# EAGLE design untitled2 (EAGLE 7.6.0)
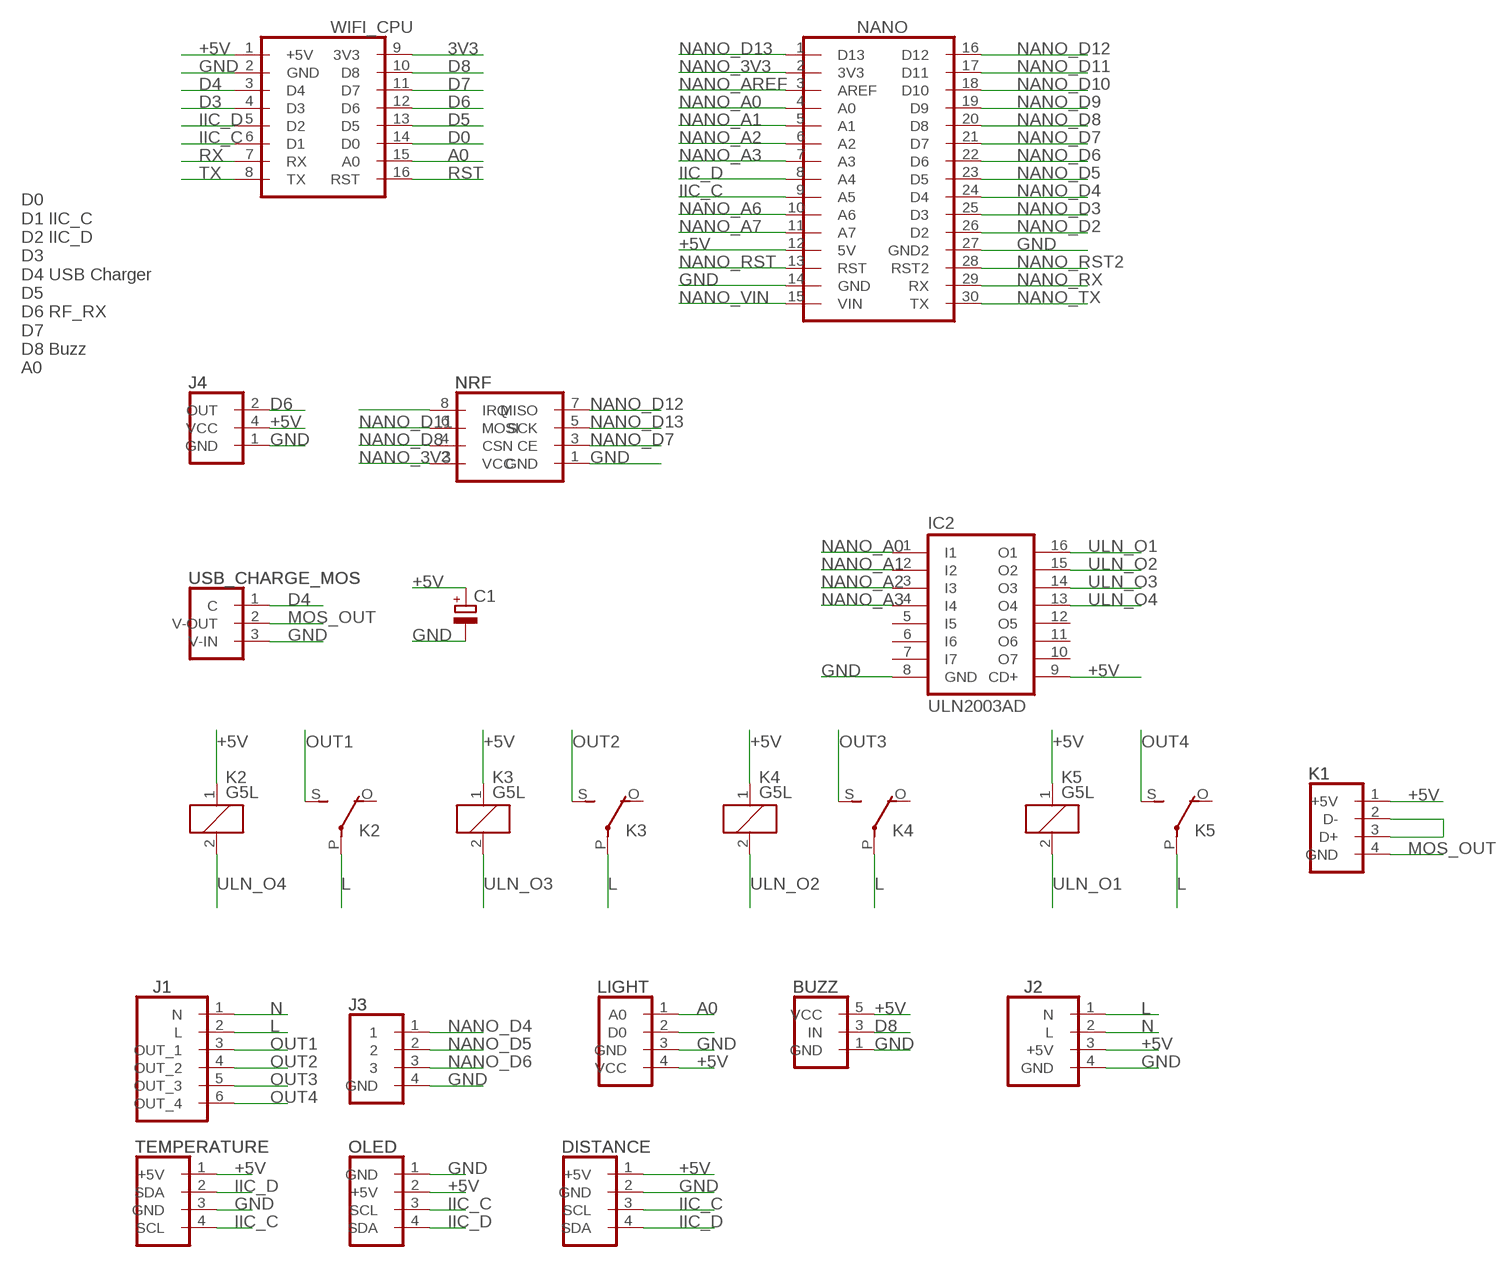
[diagram p0: schematic, sheet 1]

## Parts
BUZZ  BUZZ_MODULE  [BUZZ_MODULE]
C1  CPOL-EUE5-5  [E5-5]
DISTANCE  IIC_DISTANCE  [IIC_DISTANCE]
IC2  ULN2003AD  [SO16]
J1  OUT_HEAD_6_AC_4CH  [OUT_HEAD_6_AC_4CH]
J2  AC_DCSIDE_2A  [AC_DC_SIDE_2A]
J3  SELECT_1_IN_3  [SELECT_1_IN_3]
J4  315MHZ_RX_SMT_LONG  [315MHZ_RX_SMT_LONG]
K1  USB_OUTUSB_V  [USB_V_OUT]
K2  G5L  [G5LE]
K3  G5L  [G5LE]
K4  G5L  [G5LE]
K5  G5L  [G5LE]
LIGHT  LIGHT_DEC  [LIGHT_DEC]
NANO  ARDUINO_NANO  [ARDUINO_NANO]
NRF  NRF24L01_MODULE  [NRF24L01]
OLED  IIC_OLED  [IIC_OLED]
TEMPERATURE  IIC_TEMPERATURE  [IIC_TEMPERATURE]
USB_CHARGE_MOS  MOS_IRF520  [MOS_IRF520]
WIFI_CPU  ESP8266_MINI  [ESP8266_MINI]

## Nets
3V3: WIFI_CPU.9(3V3)
+5V: BUZZ.5(VCC) C1.+ DISTANCE.1(+5V) IC2.9(CD+) J2.3(+5V) J4.4(VCC) K1.1(+5V) K2.1 K3.1 K4.1 K5.1 LIGHT.4(VCC) NANO.12(5V) OLED.2(+5V) TEMPERATURE.1(+5V) WIFI_CPU.1(+5V)
A0: LIGHT.1(A0) WIFI_CPU.15(A0)
D0: WIFI_CPU.14(D0)
D3: WIFI_CPU.4(D3)
D4: USB_CHARGE_MOS.1(C) WIFI_CPU.3(D4)
D5: WIFI_CPU.13(D5)
D6: J4.2(OUT) WIFI_CPU.12(D6)
D7: WIFI_CPU.11(D7)
D8: BUZZ.3(IN) WIFI_CPU.10(D8)
GND: BUZZ.1(GND) C1.- DISTANCE.2(GND) IC2.8(GND) J2.4(GND) J3.4(GND) J4.1(GND) LIGHT.3(GND) NANO.14(GND) NANO.27(GND2) NRF.1(GND) OLED.1(GND) TEMPERATURE.3(GND) USB_CHARGE_MOS.3(V-IN) WIFI_CPU.2(GND)
IIC_C: DISTANCE.3(SCL) NANO.9(A5) OLED.3(SCL) TEMPERATURE.4(SCL) WIFI_CPU.6(D1)
IIC_D: DISTANCE.4(SDA) NANO.8(A4) OLED.4(SDA) TEMPERATURE.2(SDA) WIFI_CPU.5(D2)
L: J1.2(L) J2.1(N) K2.P(2:P) K3.P(2:P) K4.P(2:P) K5.P(2:P)
MOS_OUT: K1.4(GND) USB_CHARGE_MOS.2(V-OUT)
N: J1.1(N) J2.2(L)
N$1: NRF.8(IRQ)
N$2: K1.2(D-) K1.3(D+)
N$3: LIGHT.2(D0)
NANO_3V3: NANO.2(3V3) NRF.2(VCC)
NANO_A0: IC2.1(I1) NANO.4(A0)
NANO_A1: IC2.2(I2) NANO.5(A1)
NANO_A2: IC2.3(I3) NANO.6(A2)
NANO_A3: IC2.4(I4) NANO.7(A3)
NANO_A6: NANO.10(A6)
NANO_A7: NANO.11(A7)
NANO_AREF: NANO.3(AREF)
NANO_D2: NANO.26(D2)
NANO_D3: NANO.25(D3)
NANO_D4: J3.1 NANO.24(D4)
NANO_D5: J3.2 NANO.23(D5)
NANO_D6: J3.3 NANO.22(D6)
NANO_D7: NANO.21(D7) NRF.3(CE)
NANO_D8: NANO.20(D8) NRF.4(CSN)
NANO_D9: NANO.19(D9)
NANO_D10: NANO.18(D10)
NANO_D11: NANO.17(D11) NRF.6(MOSI)
NANO_D12: NANO.16(D12) NRF.7(MISO)
NANO_D13: NANO.1(D13) NRF.5(SCK)
NANO_RST: NANO.13(RST)
NANO_RST2: NANO.28(RST2)
NANO_RX: NANO.29(RX)
NANO_TX: NANO.30(TX)
NANO_VIN: NANO.15(VIN)
OUT1: J1.3(OUT_1) K2.S(2:S)
OUT2: J1.4(OUT_2) K3.S(2:S)
OUT3: J1.5(OUT_3) K4.S(2:S)
OUT4: J1.6(OUT_4) K5.S(2:S)
RST: WIFI_CPU.16(RST)
RX: WIFI_CPU.7(RX)
TX: WIFI_CPU.8(TX)
ULN_O1: IC2.16(O1) K5.2
ULN_O2: IC2.15(O2) K4.2
ULN_O3: IC2.14(O3) K3.2
ULN_O4: IC2.13(O4) K2.2
Unconnected: IC2.5(I5) IC2.6(I6) IC2.7(I7) IC2.10(O7) IC2.11(O6) IC2.12(O5) K2.O(2:O) K3.O(2:O) K4.O(2:O) K5.O(2:O)

## Notes on the sheet
- D0
  D1 IIC_C
  D2 IIC_D
  D3
  D4 USB Charger
  D5
  D6 RF_RX
  D7
  D8 Buzz
  A0

## Library data of the parts
BUZZ = rx:BUZZ_MODULE: Multi connection point. Often used as Generic Header-pin footprint for 0.1 inch spaced/style header connections On any of the 0.1 inch spaced packages, you can populate with these: Break Away Headers - Straight <https://www.sparkfun.com/products/116> (PRT-00116) Break Away Male Headers - Right Angle <https://www.sparkfun.com/products/553> (PRT-00553) Female Headers <https://www.sparkfun.com/products/115> (PRT-00115) Break Away Headers - Machine Pin <https://www.sparkfun.com/products/117> (PRT-00117) Break Away Female Headers - Swiss Machine Pin <https://www.sparkfun.com/products/743> (PRT-00743)
C1 = resistor:CPOL-EU: POLARIZED CAPACITOR, European symbol
DISTANCE = rx:IIC_DISTANCE: Multi connection point. Often used as Generic Header-pin footprint for 0.1 inch spaced/style header connections On any of the 0.1 inch spaced packages, you can populate with these: Break Away Headers - Straight <https://www.sparkfun.com/products/116> (PRT-00116) Break Away Male Headers - Right Angle <https://www.sparkfun.com/products/553> (PRT-00553) Female Headers <https://www.sparkfun.com/products/115> (PRT-00115) Break Away Headers - Machine Pin <https://www.sparkfun.com/products/117> (PRT-00117) Break Away Female Headers - Swiss Machine Pin <https://www.sparkfun.com/products/743> (PRT-00743)
IC2 = uln-udn:ULN2003A: DRIVER ARRAY
J1 = rx:OUT_HEAD_6_AC_4CH: Multi connection point. Often used as Generic Header-pin footprint for 0.1 inch spaced/style header connections On any of the 0.1 inch spaced packages, you can populate with these: Break Away Headers - Straight <https://www.sparkfun.com/products/116> (PRT-00116) Break Away Male Headers - Right Angle <https://www.sparkfun.com/products/553> (PRT-00553) Female Headers <https://www.sparkfun.com/products/115> (PRT-00115) Break Away Headers - Machine Pin <https://www.sparkfun.com/products/117> (PRT-00117) Break Away Female Headers - Swiss Machine Pin <https://www.sparkfun.com/products/743> (PRT-00743)
J2 = rx:AC_DC: Multi connection point. Often used as Generic Header-pin footprint for 0.1 inch spaced/style header connections On any of the 0.1 inch spaced packages, you can populate with these: Break Away Headers - Straight <https://www.sparkfun.com/products/116> (PRT-00116) Break Away Male Headers - Right Angle <https://www.sparkfun.com/products/553> (PRT-00553) Female Headers <https://www.sparkfun.com/products/115> (PRT-00115) Break Away Headers - Machine Pin <https://www.sparkfun.com/products/117> (PRT-00117) Break Away Female Headers - Swiss Machine Pin <https://www.sparkfun.com/products/743> (PRT-00743)
J3 = rx:SELECT_1_IN_3: Multi connection point. Often used as Generic Header-pin footprint for 0.1 inch spaced/style header connections On any of the 0.1 inch spaced packages, you can populate with these: Break Away Headers - Straight <https://www.sparkfun.com/products/116> (PRT-00116) Break Away Male Headers - Right Angle <https://www.sparkfun.com/products/553> (PRT-00553) Female Headers <https://www.sparkfun.com/products/115> (PRT-00115) Break Away Headers - Machine Pin <https://www.sparkfun.com/products/117> (PRT-00117) Break Away Female Headers - Swiss Machine Pin <https://www.sparkfun.com/products/743> (PRT-00743)
J4 = rx:315MHZ_RX_SMT_LONG: Multi connection point. Often used as Generic Header-pin footprint for 0.1 inch spaced/style header connections On any of the 0.1 inch spaced packages, you can populate with these: Break Away Headers - Straight <https://www.sparkfun.com/products/116> (PRT-00116) Break Away Male Headers - Right Angle <https://www.sparkfun.com/products/553> (PRT-00553) Female Headers <https://www.sparkfun.com/products/115> (PRT-00115) Break Away Headers - Machine Pin <https://www.sparkfun.com/products/117> (PRT-00117) Break Away Female Headers - Swiss Machine Pin <https://www.sparkfun.com/products/743> (PRT-00743)
K1 = rx:USB_OUT: Multi connection point. Often used as Generic Header-pin footprint for 0.1 inch spaced/style header connections On any of the 0.1 inch spaced packages, you can populate with these: Break Away Headers - Straight <https://www.sparkfun.com/products/116> (PRT-00116) Break Away Male Headers - Right Angle <https://www.sparkfun.com/products/553> (PRT-00553) Female Headers <https://www.sparkfun.com/products/115> (PRT-00115) Break Away Headers - Machine Pin <https://www.sparkfun.com/products/117> (PRT-00117) Break Away Female Headers - Swiss Machine Pin <https://www.sparkfun.com/products/743> (PRT-00743)
K2-K5 = relay:G5L: RELAY 1 x switch, 10 A/120 V AC, 8 A/30 V ADC, Omron; OC_FARNELL: unknown; OC_NEWARK: unknown
LIGHT = rx:LIGHT_DEC: Multi connection point. Often used as Generic Header-pin footprint for 0.1 inch spaced/style header connections On any of the 0.1 inch spaced packages, you can populate with these: Break Away Headers - Straight <https://www.sparkfun.com/products/116> (PRT-00116) Break Away Male Headers - Right Angle <https://www.sparkfun.com/products/553> (PRT-00553) Female Headers <https://www.sparkfun.com/products/115> (PRT-00115) Break Away Headers - Machine Pin <https://www.sparkfun.com/products/117> (PRT-00117) Break Away Female Headers - Swiss Machine Pin <https://www.sparkfun.com/products/743> (PRT-00743)
NANO = rx:ARDUINO_NANO: Multi connection point. Often used as Generic Header-pin footprint for 0.1 inch spaced/style header connections On any of the 0.1 inch spaced packages, you can populate with these: Break Away Headers - Straight <https://www.sparkfun.com/products/116> (PRT-00116) Break Away Male Headers - Right Angle <https://www.sparkfun.com/products/553> (PRT-00553) Female Headers <https://www.sparkfun.com/products/115> (PRT-00115) Break Away Headers - Machine Pin <https://www.sparkfun.com/products/117> (PRT-00117) Break Away Female Headers - Swiss Machine Pin <https://www.sparkfun.com/products/743> (PRT-00743) For SCREWTERMINALS and SPRING TERMINALS visit here: Screw Terimnals on SparkFun.com <https://www.sparkfun.com/search/results?term=Screw+Terminals> (5mm/3.5mm/2.54mm spacing) This device is also useful as a general connection point to wire up your design to another part of your project. Our various solder wires solder well into these plated through hole pads. Hook-Up Wire - Assortment (Stranded, 22 AWG) <https://www.sparkfun.com/products/11375> (PRT-11375) Hook-Up Wire - Assortment (Solid Core, 22 AWG) <https://www.sparkfun.com/products/11367> (PRT-11367) View the entire wire category on our website here <https://www.sparkfun.com/categories/141> Special notes: Molex polarized connector foot print use with SKU : PRT-08231 with associated crimp pins and housings. 1MM SMD Version SKU: PRT-10208 NOTES ON THE VARIANTS LOCK and LOCK_LONGPADS... This footprint was designed to help hold the alignment of a through-hole component (i.e. 6-pin header) while soldering it into place. You may notice that each hole has been shifted either up or down by 0.005 of an inch from it's more standard position (which is a perfectly straight line). This slight alteration caused the pins (the squares in the middle) to touch the edges of the holes. Because they are alternating, it causes a "brace" to hold the component in place. 0.005 has proven to be the perfect amount of "off-center" position when using our standard breakaway headers. Although looks a little odd when you look at the bare footprint, once you have a header in there, the alteration is very hard to notice. Also,if you push a header all the way into place, it is covered up entirely on the bottom side.
NRF = rx:NRF24L01_MODULE: Multi connection point. Often used as Generic Header-pin footprint for 0.1 inch spaced/style header connections On any of the 0.1 inch spaced packages, you can populate with these: Break Away Headers - Straight <https://www.sparkfun.com/products/116> (PRT-00116) Break Away Male Headers - Right Angle <https://www.sparkfun.com/products/553> (PRT-00553) Female Headers <https://www.sparkfun.com/products/115> (PRT-00115) Break Away Headers - Machine Pin <https://www.sparkfun.com/products/117> (PRT-00117) Break Away Female Headers - Swiss Machine Pin <https://www.sparkfun.com/products/743> (PRT-00743)
OLED = rx:IIC_OLED: Multi connection point. Often used as Generic Header-pin footprint for 0.1 inch spaced/style header connections On any of the 0.1 inch spaced packages, you can populate with these: Break Away Headers - Straight <https://www.sparkfun.com/products/116> (PRT-00116) Break Away Male Headers - Right Angle <https://www.sparkfun.com/products/553> (PRT-00553) Female Headers <https://www.sparkfun.com/products/115> (PRT-00115) Break Away Headers - Machine Pin <https://www.sparkfun.com/products/117> (PRT-00117) Break Away Female Headers - Swiss Machine Pin <https://www.sparkfun.com/products/743> (PRT-00743)
TEMPERATURE = rx:IIC_TEMPERATURE: Multi connection point. Often used as Generic Header-pin footprint for 0.1 inch spaced/style header connections On any of the 0.1 inch spaced packages, you can populate with these: Break Away Headers - Straight <https://www.sparkfun.com/products/116> (PRT-00116) Break Away Male Headers - Right Angle <https://www.sparkfun.com/products/553> (PRT-00553) Female Headers <https://www.sparkfun.com/products/115> (PRT-00115) Break Away Headers - Machine Pin <https://www.sparkfun.com/products/117> (PRT-00117) Break Away Female Headers - Swiss Machine Pin <https://www.sparkfun.com/products/743> (PRT-00743)
USB_CHARGE_MOS = rx:MOS_IRF520: Multi connection point. Often used as Generic Header-pin footprint for 0.1 inch spaced/style header connections On any of the 0.1 inch spaced packages, you can populate with these: Break Away Headers - Straight <https://www.sparkfun.com/products/116> (PRT-00116) Break Away Male Headers - Right Angle <https://www.sparkfun.com/products/553> (PRT-00553) Female Headers <https://www.sparkfun.com/products/115> (PRT-00115) Break Away Headers - Machine Pin <https://www.sparkfun.com/products/117> (PRT-00117) Break Away Female Headers - Swiss Machine Pin <https://www.sparkfun.com/products/743> (PRT-00743)
WIFI_CPU = rx:ESP8266_MINI: Multi connection point. Often used as Generic Header-pin footprint for 0.1 inch spaced/style header connections On any of the 0.1 inch spaced packages, you can populate with these: Break Away Headers - Straight <https://www.sparkfun.com/products/116> (PRT-00116) Break Away Male Headers - Right Angle <https://www.sparkfun.com/products/553> (PRT-00553) Female Headers <https://www.sparkfun.com/products/115> (PRT-00115) Break Away Headers - Machine Pin <https://www.sparkfun.com/products/117> (PRT-00117) Break Away Female Headers - Swiss Machine Pin <https://www.sparkfun.com/products/743> (PRT-00743)

## Board
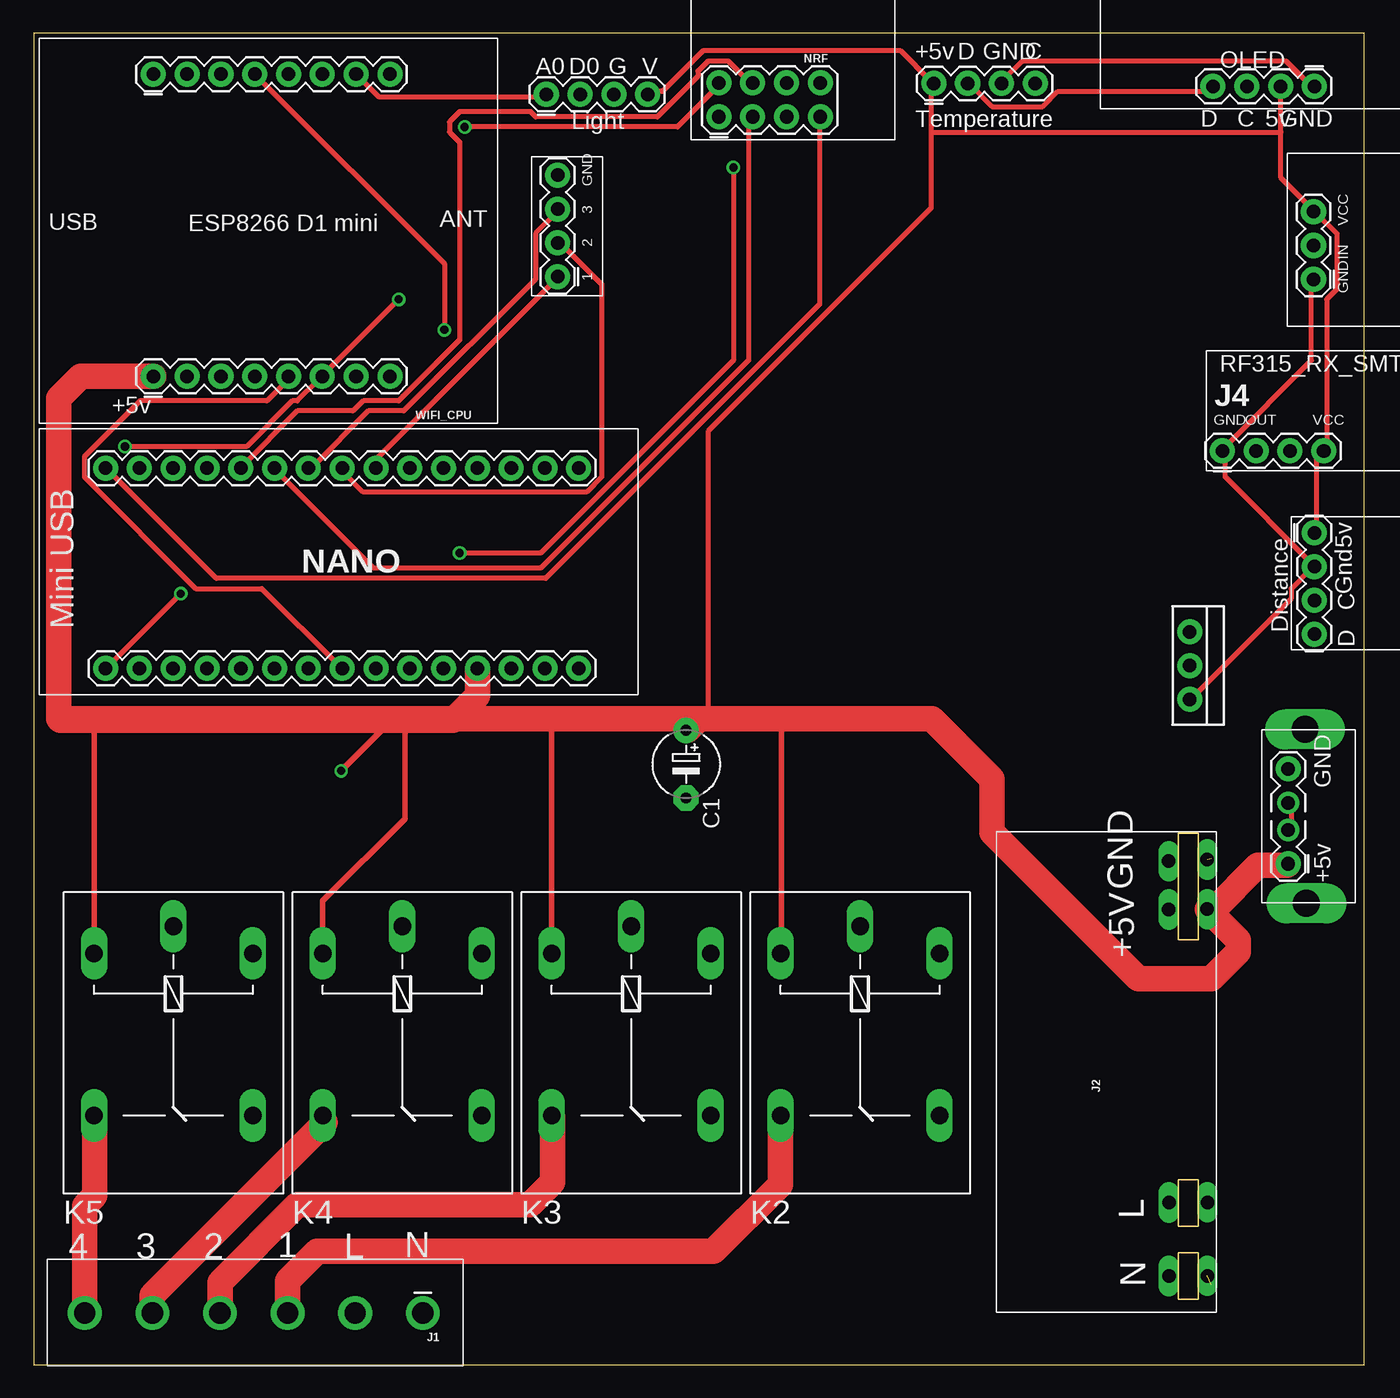
[diagram p1: board, top side]
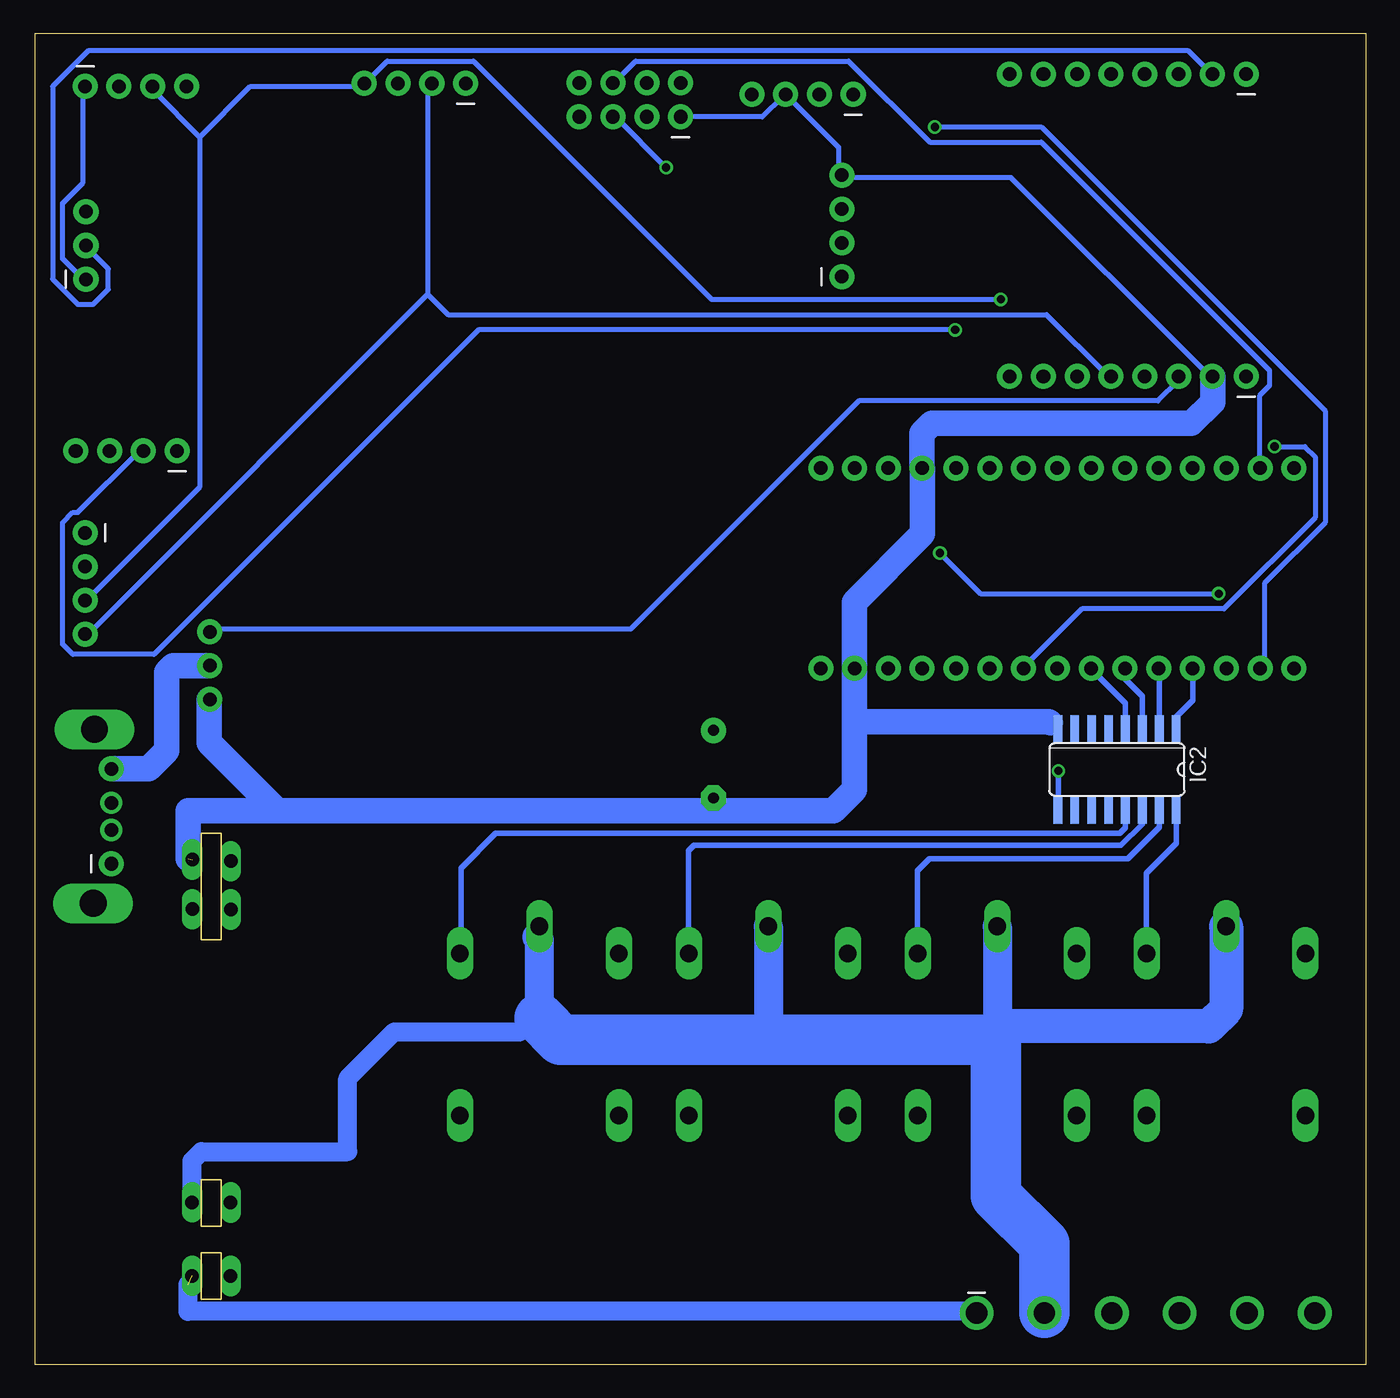
[diagram p2: board, bottom side, seen from below]

Size 100 x 100 mm. Coordinates in mm from the lower left corner, seen from the top.
Outline: 0,0 100,0 100,100 0,100 0,0
Copper layers (1*16): Top 0.035mm / dielectric 1.5mm / Bottom 0.035mm
Design rules "default *": minimum track width 15mil, minimum drill 24mil, track to track 15mil, track to pad 15mil, pad to pad 15mil, via to via 10mil, smd to smd 10mil, copper to edge 40mil, drill to drill 8mil, minimum pad ring 10mil, minimum via ring 8mil, stop-mask expansion 4mil, vias tented up to drill 0mil, thermal gap 10mil

### Footprints (pad centres in the part's own frame; a part is rotated, then mirrored left to right if it is on the bottom)
BUZZ_MODULE = drill 1.016 pad 1.88: 1 3.52,-1.97; 3 6.06,-1.97; 5 8.6,-1.97
E5-5 = drill 0.813 pad 1.905: + -2.54,0 | drill 0.813 pad 1.905 octagon: - 2.54,0
IIC_DISTANCE = drill 1.016 pad 1.88: 1 -3.78,1.73; 2 -1.24,1.73; 3 1.3,1.73; 4 3.84,1.73
SO16 = smd 0.66 x 2.032: 1 -4.445,-3.073; 2 -3.175,-3.073; 3 -1.905,-3.073; 4 -0.635,-3.073; 5 0.635,-3.073; 6 1.905,-3.073; 7 3.175,-3.073; 8 4.445,-3.073; 9 4.445,3.073; 10 3.175,3.073; 11 1.905,3.073; 12 0.635,3.073; 13 -0.635,3.073; 14 -1.905,3.073; 15 -3.175,3.073; 16 -4.445,3.073
OUT_HEAD_6_AC_4CH = drill 1.6 pad 2.54: 1 -7.14,0.22; 2 -2.06,0.22; 3 3.02,0.22; 4 8.1,0.22; 5 13.18,0.22; 6 18.26,0.22
AC_DC_SIDE_2A = drill 1.016 pad 1.27 long: 1 -27.71,-0.7; 2 -33.23,-0.7; 3 -5.69,-0.68; 4 -1.97,-0.68; 5 -27.73,2.2; 6 -33.25,2.2; 7 -5.71,2.22; 8 -2.09,2.22
SELECT_1_IN_3 = drill 1.016 pad 1.88: 1 -3.98,2.03; 2 -1.44,2.03; 3 1.1,2.03; 4 3.64,2.03
315MHZ_RX_SMT_LONG = drill 1.016 pad 1.88: 1 1.32,1.64; 2 3.86,1.64; 3 6.4,1.64; 4 8.94,1.64
USB_V_OUT = drill 1.016 pad 1.88: 1 2.92,1.53; 4 10.04,1.53 | drill 1.016 pad 1.676: 2 5.46,1.53; 3 7.5,1.53 | drill 2 pad 2.184 long: P$1 -0.05,0.17; P$2 13.02,0.27
G5LE = drill 1.321 long: 1 -7.493,-5.969; 2 -7.493,5.969; O 4.699,5.969; P -9.525,0; S 4.699,-5.969
LIGHT_DEC = drill 1.016 pad 1.88: 1 -3.68,2.03; 2 -1.14,2.03; 3 1.4,2.03; 4 3.94,2.03
ARDUINO_NANO = drill 1.016 pad 1.88: 1 -10.2,-8.1; 2 -7.66,-8.1; 3 -5.12,-8.1; 4 -2.58,-8.1; 5 -0.04,-8.1; 6 2.5,-8.1; 7 5.04,-8.1; 8 7.58,-8.1; 9 10.12,-8.1; 10 12.66,-8.1; 11 15.2,-8.1; 12 17.74,-8.1; 13 20.28,-8.1; 14 22.82,-8.1; 15 25.36,-8.1; 16 -10.2,6.93; 17 -7.66,6.93; 18 -5.12,6.93; 19 -2.58,6.93; 20 -0.04,6.93; 21 2.5,6.93; 22 5.04,6.93; 23 7.58,6.93; 24 10.12,6.93; 25 12.66,6.93; 26 15.2,6.93; 27 17.74,6.93; 28 20.28,6.93; 29 22.82,6.93; 30 25.36,6.93
NRF24L01 = drill 1.016 pad 1.88: 1 -13.21,1.73; 2 -13.21,4.27; 3 -10.67,1.73; 4 -10.67,4.27; 5 -8.13,1.73; 6 -8.13,4.27; 7 -5.59,1.73; 8 -5.59,4.27
IIC_OLED = drill 1.016 pad 1.88: 1 -3.78,-1.67; 2 -1.24,-1.67; 3 1.3,-1.67; 4 3.84,-1.67
IIC_TEMPERATURE = drill 1.016 pad 1.88: 1 -3.68,2.03; 2 -1.14,2.03; 3 1.4,2.03; 4 3.94,2.03
MOS_IRF520 = drill 1.016 pad 1.88: 1 -3.68,2.03; 2 -1.14,2.03; 3 1.4,2.03
ESP8266_MINI = drill 1.016 pad 1.88: 1 -10.61,1.53; 2 -8.07,1.53; 3 -5.53,1.53; 4 -2.99,1.53; 5 -0.45,1.53; 6 2.09,1.53; 7 4.63,1.53; 8 7.17,1.53; 9 -10.61,24.23; 10 -8.07,24.23; 11 -5.53,24.23; 12 -2.99,24.23; 13 -0.45,24.23; 14 2.09,24.23; 15 4.63,24.23; 16 7.17,24.23

### Placement (x,y rotation side)
BUZZ  94.2,78 90 top
C1  49.02,45.1 270 top
DISTANCE  94.5,58.7 270 top
IC2  18.7,44.7 180 bottom
J1  22.1,4.1 180 top
J2  87.5,39.9 90 top
J3  41.4,85.7 90 top
J4  88,67 0 top
K1  95.8,34.7 90 top
K2  62.1,23.4 270 top
K3  44.9,23.4 270 top
K4  27.7,23.4 270 top
K5  10.5,23.4 270 top
LIGHT  42.2,93.38 0 top
NANO  15.6,60.4 0 top
NRF  64.7,92 0 top
OLED  92.46,94.34 180 top
TEMPERATURE  71.32,94.2 0 top
USB_CHARGE_MOS  84.84,51.36 270 top
WIFI_CPU  19.6,72.7 0 top

### Tracks (layer width: path | path; a pad name or v marks a point on that pad's centre or on a via)
+5V  (via drill 0.6)
  Top 0.381: DISTANCE.1 96.39,62.48 96.39,68.2 96.77,68.58 J4.4 97.16,68.96 97.16,80.01 97.92,80.77 97.92,84.96 96.39,86.49 BUZZ.5 96.01,86.87 93.73,89.15 93.73,92.58 | 93.73,92.58 93.73,95.63 OLED.2 | 67.44,92.58 67.44,96.01 TEMPERATURE.1 67.44,96.39 65.15,98.68 50.29,98.68 47.24,95.63 46.48,95.63 LIGHT.4 | 67.44,92.58 67.44,86.87 50.67,70.1 50.67,49.15 50,48.5 | 67.44,92.58 93.73,92.58
  Top 0.406: v23.1,44.6 26.9,48.4 28.4,48.4 27.9,47.9 27.9,41 21.73,34.83 K4.1 | K5.1 4.53,47.87 4,48.4 | K3.1 38.93,48.07 38.5,48.5 | K2.1 56.19,30.89 56.2,30.9 56.2,48.4 56.3,48.5
  Top 1.93: 1.9,48.5 1.9,72.6 3.53,74.23 WIFI_CPU.1 v9,74.24 | NANO.12 33.34,50.24 31.5,48.4 28.4,48.4 4,48.4 2,48.4 1.9,48.5 | 1.9,48.5 38.5,48.5 50,48.5 | 50,48.5 56.3,48.5 67.5,48.5 72,44 72,40 83,29 88.5,29 90.5,31 90.5,31.89 J2.3 88.72,34.22 92,37.5 94.15,37.5 K1.1 | C1.+ 49.14,47.64 50,48.5
  Bottom 0.381: IC2.9 23.24,41.91 23.24,42.29 23.1,42.3
  Bottom 0.406: v23.1,44.6 23.1,42.3
A0
  Top 0.381: LIGHT.1 38.48,95.25 25.91,95.25 24.38,96.77 WIFI_CPU.15
D4
  Bottom 0.381: USB_CHARGE_MOS.1 86.87,55.24 55.24,55.24 38.1,72.39 15.62,72.39 14.1,73.91 WIFI_CPU.3
D6  (via drill 0.61)
  Top 0.381: v30.86,77.72 30.86,82.68 16.76,96.77 WIFI_CPU.12
  Bottom 0.381: v30.86,77.72 66.67,77.72 91.06,53.34 97.16,53.34 97.92,54.1 97.92,63.25 97.16,64.01 96.77,64.01 92.2,68.58 J4.2
D8
  Bottom 0.381: BUZZ.3 96.01,83.82 94.49,82.3 94.49,80.77 95.63,79.63 96.77,79.63 98.68,81.53 98.68,96.01 96.01,98.68 13.34,98.68 11.81,97.16 WIFI_CPU.10
GND  (1 unrouted)
  Top 0.381: BUZZ.1 96.01,81.15 96.01,75.44 89.53,68.96 J4.1 89.53,68.58 89.53,66.67 96.01,60.2 DISTANCE.2 96.01,59.82 94.49,58.29 94.49,57.53 87.25,50.29 USB_CHARGE_MOS.3 | TEMPERATURE.3 72.77,96.39 74.3,97.92 94.11,97.92 96.01,96.01 OLED.1
  Bottom 0.381: NRF.1 51.44,93.73 45.34,93.73 43.81,95.25 LIGHT.3 43.43,95.25 39.62,91.44 39.62,89.53 J3.4 39.24,89.15 26.67,89.15 12.19,74.68 WIFI_CPU.2 | OLED.1 96.39,95.63 96.39,88.77 97.92,87.25 97.92,83.06 96.39,81.53 BUZZ.1
  Bottom 0.406: IC2.8 23.67,47.77 24.2,48.3
  Bottom 1.93: 38.42,48.5 NANO.14 38.42,57.28 33.3,62.4 33.3,67.29 NANO.27 33.34,69.96 32.6,70.7 13.1,70.7 11.5,72.3 11.5,74.2 WIFI_CPU.2 | 38.42,48.5 38.42,43.18 40,41.6 49,41.6 | 49,41.6 81.8,41.6 | 38.42,48.5 38.22,48.3 24.2,48.3 23.8,48.3 23.7,48.2 | 81.8,41.6 86.9,46.7 86.9,49.93 USB_CHARGE_MOS.3 | C1.- 49.02,41.62 49,41.6 | 81.8,41.6 88.5,41.6 88.5,38
IIC_C  (via drill 0.61)
  Top 0.381: v6.86,68.96 16,68.96 19.43,72.39 19.81,72.39 21.34,73.91 WIFI_CPU.6 21.72,74.3 v27.43,80.01
  Bottom 0.381: v6.86,68.96 4.57,68.96 3.81,68.2 3.81,63.63 10.67,56.77 21.34,56.77 25.53,52.58 NANO.9 | 87.63,92.2 87.63,65.91 96.01,57.53 DISTANCE.3 | 87.63,92.2 91.06,95.63 OLED.3 | 87.63,92.2 83.82,96.01 75.44,96.01 TEMPERATURE.4 75.06,96.39 73.53,97.92 67.06,97.92 49.15,80.01 v27.43,80.01
IIC_D
  Top 0.381: NANO.8 22.86,52.58 17.14,58.29 12.19,58.29 3.81,66.67 3.81,68.2 8,72.39 17.53,72.39 19.05,73.91 WIFI_CPU.5 | OLED.4 88.39,95.63 76.96,95.63 75.82,94.49 72.01,94.49 70.48,96.01 TEMPERATURE.2
  Bottom 0.381: 70.48,80.39 96.01,54.86 DISTANCE.4 | 70.48,80.39 70.48,96.01 TEMPERATURE.2 | 70.48,80.39 68.96,78.87 24,78.87 19.43,74.3 WIFI_CPU.5
L
  Bottom 1.422: 62.4,26.4 62.1,26.7 | J2.1 88.2,15.3 87.5,16 76.5,16 76.5,21.5 73,25 63.6,25 62.1,26.5 | K2.P 62.1,31
  Bottom 2.184: 62.1,26 62.1,26.5 62.1,26.7 62.1,31 62.1,31.9 62.3,32.1 | K3.P 44.9,24.8 44.5,24.4 | K4.P 27.7,25.3 27.7,24.3 27.8,24.2
  Bottom 2.54: K5.P 10.5,26.7 11.8,25.4 27.6,25.4 27.7,25.3
  Bottom 3.81: J1.2 24.16,9.06 27.8,12.7 27.8,24.2 27.8,24.4 44.5,24.4 60.5,24.4 62.1,26
MOS_OUT
  Bottom 1.93: K1.4 91.46,44.74 90.1,46.1 90.1,52 89.6,52.5 USB_CHARGE_MOS.2
N  (1 unrouted)
  Bottom 1.422: J1.1 29.36,4 88.5,4 88.5,6
N$2
  Top 0.381: K1.2 94.49,40.39 94.49,41.91 K1.3
NANO_3V3  (via drill 0.61)
  Top 0.381: v32.38,92.96 48.39,92.96 51.44,96.01 NRF.2
  Bottom 0.381: v32.38,92.96 24.38,92.96 3.05,71.63 3.05,63.25 7.62,58.67 7.62,52.58 NANO.2
NANO_A0
  Bottom 0.406: IC2.1 14.26,48.65 13,49.9 13,52.28 NANO.4
NANO_A1
  Bottom 0.406: IC2.2 15.53,52.27 NANO.5
NANO_A2
  Bottom 0.406: IC2.3 16.8,50.2 18.1,51.5 NANO.6
NANO_A3
  Bottom 0.406: NANO.7 20.64,52.24 18.07,49.66 IC2.4
NANO_D4
  Top 0.381: NANO.24 25.91,67.44 25.91,68.2 39.24,81.53 J3.1
NANO_D5
  Top 0.381: NANO.23 23.24,67.06 24.77,65.53 41.53,65.53 42.67,66.67 42.67,81.15 39.62,84.2 J3.2
NANO_D6
  Top 0.381: NANO.22 20.95,67.44 25.15,71.63 27.81,71.63 37.72,81.53 37.72,84.96 39.24,86.49 J3.3
NANO_D7
  Top 0.381: NANO.21 18.29,67.06 25.53,59.82 38.1,59.82 53.72,75.44 53.72,93.73 NRF.3
NANO_D8
  Top 0.381: NANO.20 15.62,67.44 19.81,71.63 24,71.63 24.77,72.39 27.43,72.39 32,76.96 32,91.82 31.24,92.58 31.24,93.34 32,94.11 37.34,94.11 37.72,93.73 46.86,93.73 49.91,96.77 49.91,97.16 50.67,97.92 52.2,97.92 53.72,96.39 NRF.4
NANO_D11
  Bottom 0.381: NANO.17 8,67.44 8,72.77 7.24,73.53 7.24,74.68 24.38,91.82 32.77,91.82 38.86,97.92 54.86,97.92 56.39,96.39 NRF.6
NANO_D12
  Top 0.381: NANO.16 5.71,67.06 13.72,59.05 38.48,59.05 59.05,79.63 59.05,93.73 NRF.7
NANO_D13  (via drill 0.61)
  Top 0.381: v11.05,57.91 5.71,52.58 NANO.1 | v32,60.96 38.1,60.96 52.58,75.44 v52.58,89.92
  Bottom 0.381: v11.05,57.91 28.96,57.91 v32,60.96 | v52.58,89.92 56.39,93.73 NRF.5
OUT1
  Top 1.93: J1.3 19.08,6.28 21.3,8.5 51.1,8.5 56.1,13.5 56.1,18.67 K2.S
OUT2
  Top 1.93: J1.4 14,6.2 19.8,12 37.3,12 39,13.7 39,18.63 K3.S
OUT3
  Top 0.381: K4.S 21.72,18.67 21.9,18.2
  Top 1.93: J1.5 8.92,5.22 21.9,18.2
OUT4
  Top 1.93: J1.6 3.84,11.94 4.6,12.7 4.6,18.63 K5.S
ULN_O1
  Bottom 0.381: K5.2 16.38,31.24 16.38,32 16.4,32.2
  Bottom 0.406: IC2.16 14.26,39.15 16.5,36.9 16.5,32.3 16.4,32.2
ULN_O2
  Bottom 0.406: IC2.15 15.53,40.38 17.9,38 32.8,38 33.7,37.1 33.7,30.92 K4.2
ULN_O3
  Bottom 0.406: IC2.14 16.8,40.6 18.4,39 50.5,39 50.9,38.6 50.9,30.92 K3.2
ULN_O4
  Bottom 0.406: IC2.13 18.07,40.34 18.5,39.9 65.4,39.9 68,37.3 68,30.96 K2.2